# Altium project PSat Generic PSU.PrjPcb
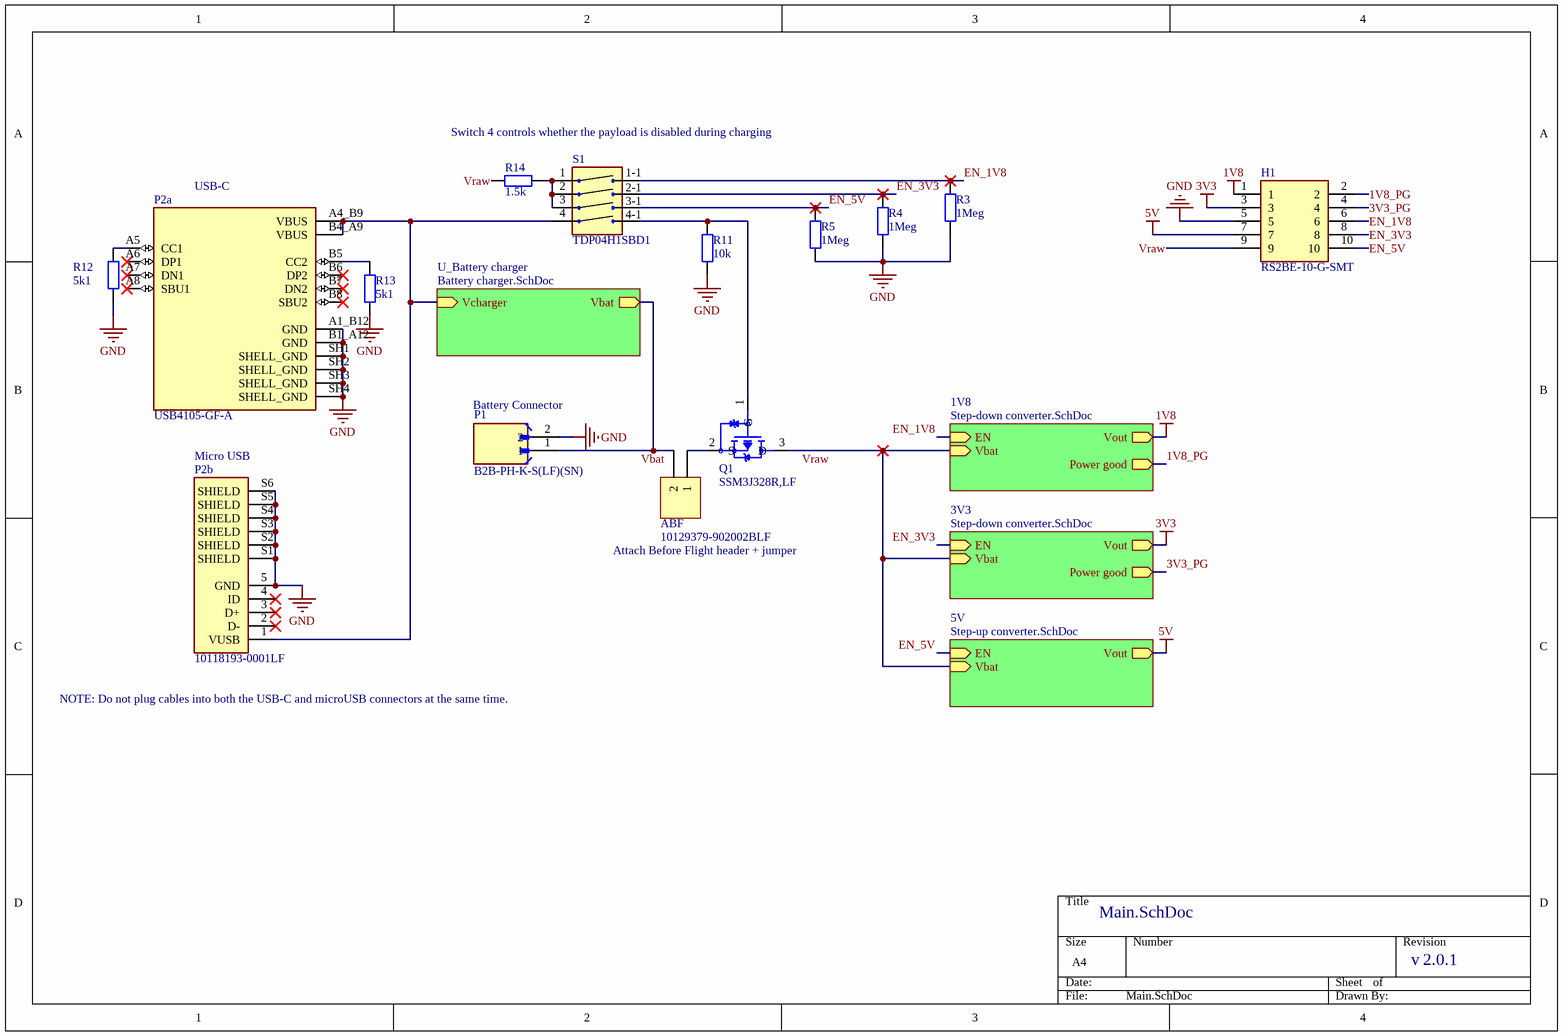
[diagram p0: Main.SchDoc]
Version: 2.0.1
4 sheets, 44 parts. Net scope: hierarchical (ports join the sheet entries above them; power ports are global).
Board file: PSU.PcbDoc
Sheets:
  Main.SchDoc
    1V8 = Step-down converter.SchDoc
    3V3 = Step-down converter.SchDoc
    U_Battery charger = Battery charger.SchDoc
    5V = Step-up converter.SchDoc

## Sheet Main.SchDoc
size A4; SheetNumber: 1; SheetTotal: 4

### Parts
ABF  10129379-902002BLF  [ECE-600102STTH-RA]
H1  RS2BE-10-G-SMT  [RS2BE10GSMT]
P1  B2B-PH-K-S(LF)(SN)  [JST_B2B-PH-K-S(LF)(SN)]
P2a  USB4105-GF-A  [GCT_USB4105-GF-A]
P2b  10118193-0001LF  [AMPHENOL_10118193-0001LF]
Q1  SSM3J328R,LF  [SOT95P240X88-3N]
R3  1Meg  [0805]
R4  1Meg  [0805]
R5  1Meg  [0805]
R11  10k  [0805]
R12  5k1  [0805]
R13  5k1  [0805]
R14  1.5k  [0805]
S1  TDP04H1SBD1  [TDP04H1SBD1]

### Sub-sheets
1V8 = Step-down converter.SchDoc: EN (in), Vbat (in), Power good (out), Vout (out)  | R_FB1_Value: 200k; R_FB2_Value: 100k
3V3 = Step-down converter.SchDoc: EN (in), Vbat (in), Power good (out), Vout (out)  | R_FB1_Value: 910k; R_FB2_Value: 200k
5V = Step-up converter.SchDoc: EN (in), Vbat (in), Vout (out)  | R_FB1_Value: 910k; R_FB2_Value: 100k
U_Battery charger = Battery charger.SchDoc: Vbat (out), Vcharger (in)

### Nets
1V8: H1.1 ; sheet 1V8/Vout
3V3: H1.3 ; sheet 3V3/Vout
5V: H1.7 ; sheet 5V/Vout
GND: H1.5 P1.2 P2a.A1_B12(GND) P2a.B1_A12(GND) P2a.SH1(SHELL_GND) P2a.SH2(SHELL_GND) P2a.SH3(SHELL_GND) P2a.SH4(SHELL_GND) P2b.5(GND) P2b.S1(SHIELD) P2b.S2(SHIELD) P2b.S3(SHIELD) P2b.S4(SHIELD) P2b.S5(SHIELD) P2b.S6(SHIELD) R3.2 R4.2 R5.2 R11.1 R12.2 R13.1
1V8_PG: H1.2 ; sheet 1V8/Power good
3V3_PG: H1.4 ; sheet 3V3/Power good
EN_1V8: H1.6 R3.1 S1.8(1-1) ; sheet 1V8/EN
EN_3V3: H1.8 R4.1 S1.7(2-1) ; sheet 3V3/EN
EN_5V: H1.10 R5.1 S1.6(3-1) ; sheet 5V/EN
Vbat: ABF.2 P1.1 ; sheet U_Battery charger/Vbat
Vraw: H1.9 Q1.3(D) R14.1 ; sheet 1V8/Vbat, sheet 3V3/Vbat, sheet 5V/Vbat
NetABF_1: ABF.1 Q1.2(S)
NetC6_2: P2a.A4_B9(VBUS) P2a.B4_A9(VBUS) P2b.1(VUSB) S1.4 ; sheet U_Battery charger/Vcharger
NetP2a_A5: P2a.A5(CC1) R12.1
NetP2a_B5: P2a.B5(CC2) R13.2
NetQ1_1: Q1.1(G) R11.2 S1.5(4-1)
NetR14_2: R14.2 S1.1 S1.2 S1.3

Not connected (* = marked no-connect by the designer): P2a A6(DP1)* A7(DN1)* A8(SBU1)* B6(DP2)* B7(DN2)* B8(SBU2)*; P2b 2(D-)* 3(D+)* 4(ID)*

### Notes on the sheet
- Switch 4 controls whether the payload is disabled during charging
- (near P2a) USB-C
- (near P1) Battery Connector
- (near P2b) Micro USB
- Attach Before Flight header + jumper
- NOTE: Do not plug cables into both the USB-C and microUSB connectors at the same time.
- v

### Library data of the parts
ABF = Header 2: Short Before Flight
H1 = RS2BE-10-G-SMT: Receptacle Strip 10P 2.54mm Pitch SMT; Manufacturer_Name: Adam Tech; Geometry.Height: 5.05mm; Manufacturer_Part_Number: RS2BE-10-G-SMT; Mouser Part Number: *; Mouser Price/Stock: *; Arrow Part Number: *; Arrow Price/Stock: *; Datasheet Link: *
P1 = B2B-PH-K-S(LF)(SN): Connector Header Through Hole 2 position 0.079 (2.00mm); MF: JST; SnapEDA_Link: https://www.snapeda.com/parts/B2B-PH-K-S%20(LF)(SN)/JST/view-part/?ref=snap; Package: None; Value: *; MP: B2B-PH-K-S (LF)(SN); Check_prices: https://www.snapeda.com/parts/B2B-PH-K-S%20(LF)(SN)/JST/view-part/?ref=eda
P2a = USB4105-GF-A: USB-C (USB TYPE-C) USB 2.0 Receptacle Connector 24 (16+8 Dummy) Position Surface Mount, Right Angle; Through Hole; MF: GCT; SnapEDA_Link: https://www.snapeda.com/parts/USB4105-GF-A/Global+Connector+Technology/view-part/?ref=snap; Package: None; Value: *; MP: USB4105-GF-A; Check_prices: https://www.snapeda.com/parts/USB4105-GF-A/Global+Connector+Technology/view-part/?ref=eda
P2b = 10118193-0001LF: Micro USB 2.0, Input Output Connectors, B TYPE RECEPTACLE; MF: Amphenol ICC; Value: *; MP: 10118193-0001LF; Package: None; Check_prices: https://www.snapeda.com/parts/10118193-0001LF/Amphenol+FCI/view-part/?ref=eda; Purchase-URL: https://pricing.snapeda.com/search/part/10118193-0001LF/?ref=eda; Price: None; Availability: In Stock; SnapEDA_Link: https://www.snapeda.com/parts/10118193-0001LF/Amphenol+FCI/view-part/?ref=snap
Q1 = SSM3J328R,LF: P-Channel 20V 6A _Ta_ 1W _Ta_ Surface Mount SOT-23F; MF: Toshiba; MP: SSM3J328R,LF; SnapEDA_Link: https://www.snapeda.com/parts/SSM3J328R,LF/Toshiba%20Semiconductor%20and%20Storage/view-part/214715/?ref=snap; Availability: Unavailable; Package: SOT-23 Toshiba; Value: *; Price: None
R3-R5 R12 R13 = Res 0805: Resistor; Value: 100k; IsInLabBook: Yes
R11 R14 = Res 0805: Resistor; IsInLabBook: Yes
  R11: Value: 10k
  R14: Value: 1.5k
S1 = TDP04H1SBD1: Switch; Manufacturer_Name: C & K COMPONENTS; Datasheet Link: https://www.ckswitches.com/media/1330/tdp.pdf; Height: 4.4mm; Manufacturer_Part_Number: TDP04H1SBD1; Mouser Part Number: 611-TDP04H1SBD1; Mouser Price/Stock: https://www.mouser.co.uk/ProductDetail/CK/TDP04H1SBD1?qs=LUL%252B3%2F1oFk7o6Dk5%252BAVXHw%3D%3D; Arrow Part Number: TDP04H1SBD1; Arrow Price/Stock: https://www.arrow.com/en/products/tdp04h1sbd1/ck?region=nac

## Sheet Step-down converter.SchDoc
size A4; SheetNumber: 2; SheetTotal: 4
Used 2 times, as channels 1V8, 3V3. Parts and nets are listed once, with the designators drawn on the sheet.
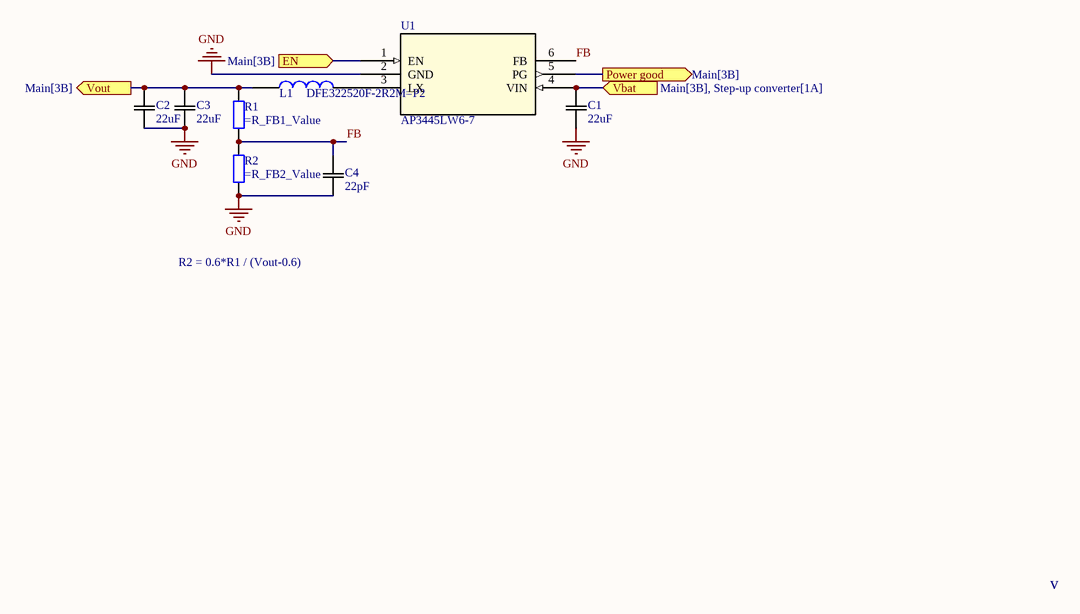
[diagram p1: Step-down converter.SchDoc]

### Parts
C1  22uF  [CAPC2012X94N]
C2  22uF  [CAPC2012X94N]
C3  22uF  [CAPC2012X94N]
C4  22pF  [CAPC2012X94N]
L1  DFE322520F-2R2M=P2  [INDC3225X200N]
R1  (no value)  [0805]
R2  (no value)  [0805]
U1  AP3445LW6-7  [SOT26_AP3445_DIO]

### Ports
EN (in, see Main[3B]), Power good (out, see Main[3B]), Vbat (in, see Main[3B], Step-up converter[1A]), Vout (out, see Main[3B])

### Nets
GND: C1.1 C2.1 C3.1 C4.1 R2.1 U1.2(GND)
EN: U1.1(EN) ; port EN
FB: C4.2 R1.1 R2.2 U1.6(FB)
Power good: U1.5(PG) ; port Power good
Vbat: C1.2 U1.4(VIN) ; port Vbat
Vout: C2.2 C3.2 L1.1 R1.2 ; port Vout
NetL1_2: L1.2 U1.3(LX)

### Channels
1V8: designators end in #1; ports EN=EN_1V8 Power good=1V8_PG Vbat=Vraw Vout=1V8
3V3: designators end in #2; ports EN=EN_3V3 Power good=3V3_PG Vbat=Vraw Vout=3V3

### Notes on the sheet
- R2 = 0.6*R1 / (Vout-0.6)
- v

### Library data of the parts
C1-C4 = CAP 0805: No Description Available; IsInLabBook: Yes
  C1-C3: Value: 22uF
  C4: Value: 22pF
L1 = DFE322520F-2R2M=P2: 2.2 H Shielded Wirewound Inductor 3.3 A 40mOhm Max 1210 (3225 Metric); Manufacturer_Name: Murata Electronics; Geometry.Height: 2mm; Avnet Part Number: *; Avnet Price/Stock: *; Manufacturer_Part_Number: DFE322520F-2R2M=P2; Datasheet Link: https://www.murata.com/-/media/webrenewal/support/library/catalog/products/inductor/chip/o05e.ashx?la=en-us
R1 R2 = Res 0805: Resistor; IsInLabBook: Check
  R1: Value: =R_FB1_Value
  R2: Value: =R_FB2_Value
U1 = AP3445LW6-7: No Description Available; Mfr_Name: Diodes Inc; Copyright: Copyright (C) 2024 Ultra Librarian. All rights reserved.; Manufacturer_Part_Number: AP3445LW6-7; RefDes: RefDes; Type: DEV

## Sheet Battery charger.SchDoc
size A4; SheetNumber: 3; SheetTotal: 4
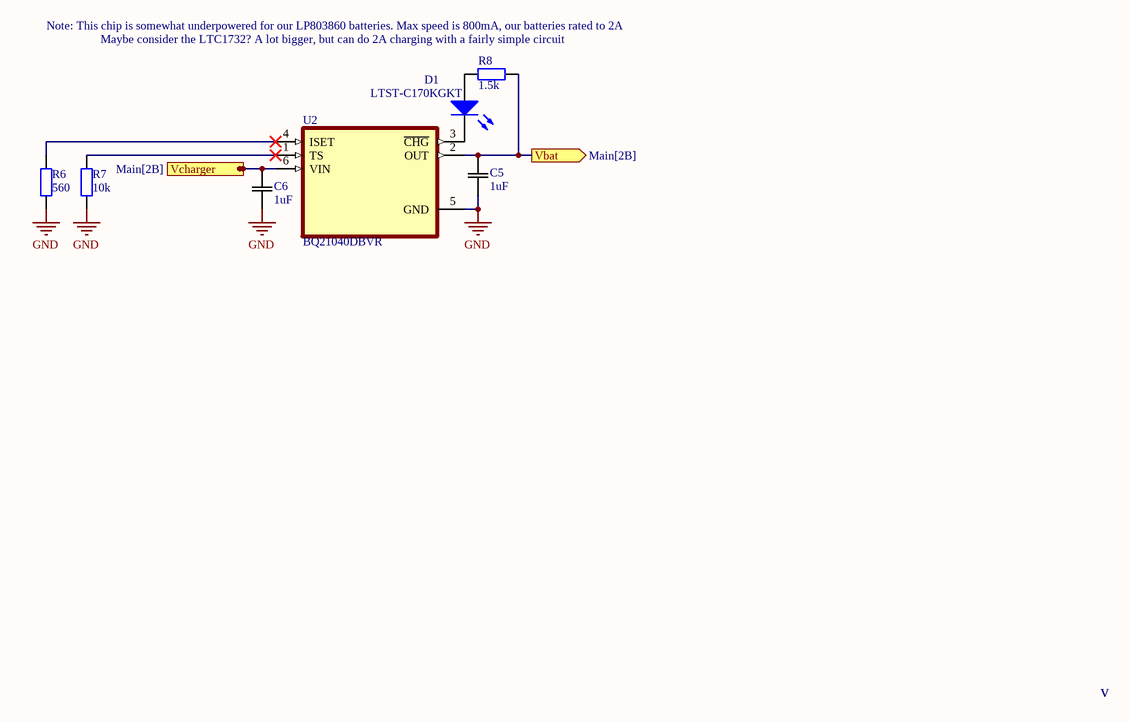
[diagram p2: Battery charger.SchDoc]

### Parts
C5  1uF  [CAPC2012X94N]
C6  1uF  [CAPC2012X94N]
D1  LTST-C170KGKT  [ECE-LED2012-0805SM]
R6  560  [0805]
R7  10k  [0805]
R8  1.5k  [0805]
U2  BQ21040DBVR  [SOT95P280X145-6N]

### Ports
Vbat (out, see Main[2B]), Vcharger (in, see Main[2B])

### Nets
GND: C5.1 C6.1 R6.1 R7.1 U2.5(GND)
Vbat: C5.2 R8.2 U2.2(OUT) ; port Vbat
NetC6_2: C6.2 U2.6(VIN) ; port Vcharger
NetD1_1: D1.1(A) R8.1
NetD1_2: D1.2(K) U2.3(~{CHG})
NetR6_2: R6.2 U2.4(ISET)
NetR7_2: R7.2 U2.1(TS)

### Notes on the sheet
- (near R8) Note: This chip is somewhat underpowered for our LP803860 batteries. Max speed is 800mA, our batteries rated to 2A
- (near R8) Maybe consider the LTC1732? A lot bigger, but can do 2A charging with a fairly simple circuit
- v

### Library data of the parts
C5 C6 = CAP 0805: as C1 on sheet Step-down converter; Value: 1uF
D1 = LED
R6-R8 = Res 0805: Resistor; IsInLabBook: Yes
  R6: Value: 560
  R7: Value: 10k
  R8: Value: 1.5k
U2 = BQ21040DBVR: 1-cell, 0.8-A Li-ion and Li-polymer battery charger; MF: Texas Instruments; SnapEDA_Link: https://www.snapeda.com/parts/BQ21040DBVR/Texas+Instruments/view-part/?ref=snap; Package: SOT-23-6 Texas Instruments; MP: BQ21040DBVR; Check_prices: https://www.snapeda.com/parts/BQ21040DBVR/Texas+Instruments/view-part/?ref=eda; Purchase-URL: https://pricing.snapeda.com/search/part/BQ21040DBVR/?ref=eda; Price: None; Value: *; Availability: In Stock

## Sheet Step-up converter.SchDoc
size A4; SheetNumber: 4; SheetTotal: 4
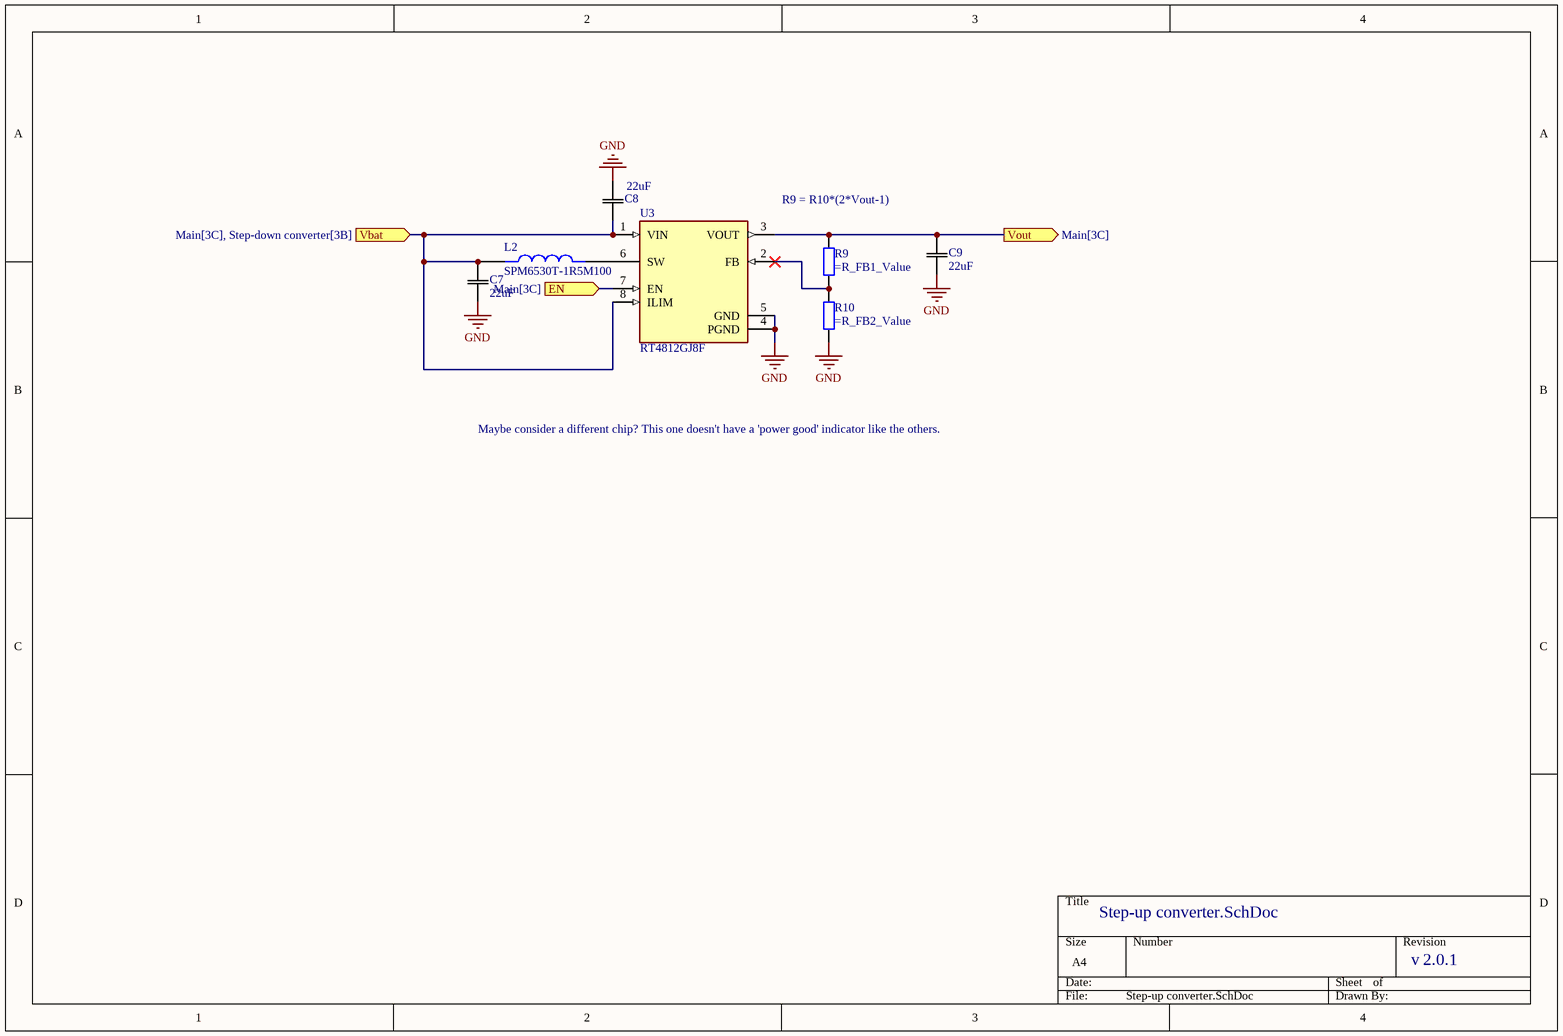
[diagram p3: Step-up converter.SchDoc]

### Parts
C7  22uF  [CAPC2012X94N]
C8  22uF  [CAPC2012X94N]
C9  22uF  [CAPC2012X94N]
L2  SPM6530T-1R5M100  [IND_SPM6530T-1R5M100]
R9  (no value)  [0805]
R10  (no value)  [0805]
U3  RT4812GJ8F  [SOT65P279X100-8N]

### Ports
EN (in, see Main[3C]), Vbat (in, see Main[3C], Step-down converter[3B]), Vout (out, see Main[3C])

### Nets
5V: C9.2 R9.2 U3.3(VOUT) ; port Vout
GND: C7.1 C8.2 C9.1 R10.1 U3.4(PGND) U3.5(GND)
EN_5V: U3.7(EN) ; port EN
Vraw: C7.2 C8.1 L2.1 U3.1(VIN) U3.8(ILIM) ; port Vbat
NetL2_2: L2.2 U3.6(SW)
NetR9_1: R9.1 R10.2 U3.2(FB)

### Notes on the sheet
- R9 = R10*(2*Vout-1)
- Maybe consider a different chip? This one doesn't have a 'power good' indicator like the others.
- v

### Library data of the parts
C7-C9 = CAP 0805: as C1 on sheet Step-down converter; Value: 22uF
L2 = SPM6530T-1R5M100: 1.5 ÂµH Shielded Drum Core, Wirewound Inductor 11 A 10.67mOhm Max Nonstandard; MF: TDK; Value: *; Digi-Key_Part_Number: 445-3881-2-ND; Check_prices: https://www.snapeda.com/parts/SPM6530T-1R5M100/TDK/view-part/?ref=eda; Package: NON STANDARD-2 TDK; SnapEDA_Link: https://www.snapeda.com/parts/SPM6530T-1R5M100/TDK/view-part/?ref=snap; MP: SPM6530T-1R5M100; Purchase-URL: https://pricing.snapeda.com/search/part/SPM6530T-1R5M100/?ref=eda
R9 R10 = Res 0805: Resistor; IsInLabBook: Check; Value: =R_FB1_Value
U3 = RT4812GJ8F: Boost Switching Regulator IC Positive Adjustable 1.8V 1 Output 2A SOT-23-8 Thin, TSOT-23-8; MF: Richtek USA; Value: *; Availability: Unavailable; Price: None; SnapEDA_Link: https://www.snapeda.com/parts/RT4812GJ8F/Richtek%20USA%20Inc./view-part/699858/?ref=snap; DigiKey-Purchase-URL: https://snapeda.com/shop?store=DigiKey&id=699858; Package: TSOT-23 Richtek; MP: RT4812GJ8F

## Nets that join several sheets
1V8: Main (H1.1), 1V8 (C2#1.2 C3#1.2 L1#1.1 R1#1.2)
3V3: Main (H1.3), 3V3 (C2#2.2 C3#2.2 L1#2.1 R1#2.2)
5V: Main (H1.7), Step-up converter (C9.2 R9.2 U3.3)
GND: Main (21 pins), 1V8 (6 pins), 3V3 (6 pins), Battery charger (5 pins), Step-up converter (6 pins)
1V8_PG: Main (H1.2), 1V8 (U1#1.5)
3V3_PG: Main (H1.4), 3V3 (U1#2.5)
EN_1V8: Main (H1.6 R3.1 S1.8), 1V8 (U1#1.1)
EN_3V3: Main (H1.8 R4.1 S1.7), 3V3 (U1#2.1)
EN_5V: Main (H1.10 R5.1 S1.6), Step-up converter (U3.7)
NetC6_2: Main (P2a.A4_B9 P2a.B4_A9 P2b.1 S1.4), Battery charger (C6.2 U2.6)
Vbat: Main (ABF.2 P1.1), Battery charger (C5.2 R8.2 U2.2)
Vraw: Main (H1.9 Q1.3 R14.1), 1V8 (C1#1.2 U1#1.4), 3V3 (C1#2.2 U1#2.4), Step-up converter (5 pins)

## Assembly variants
USB-C: not fitted J2b P2
Micro USB: not fitted J2a R? R?